# EAGLE schematic OSSI-1 Interface Board (EAGLE 6.5.0)

## Sheet 1 of 2
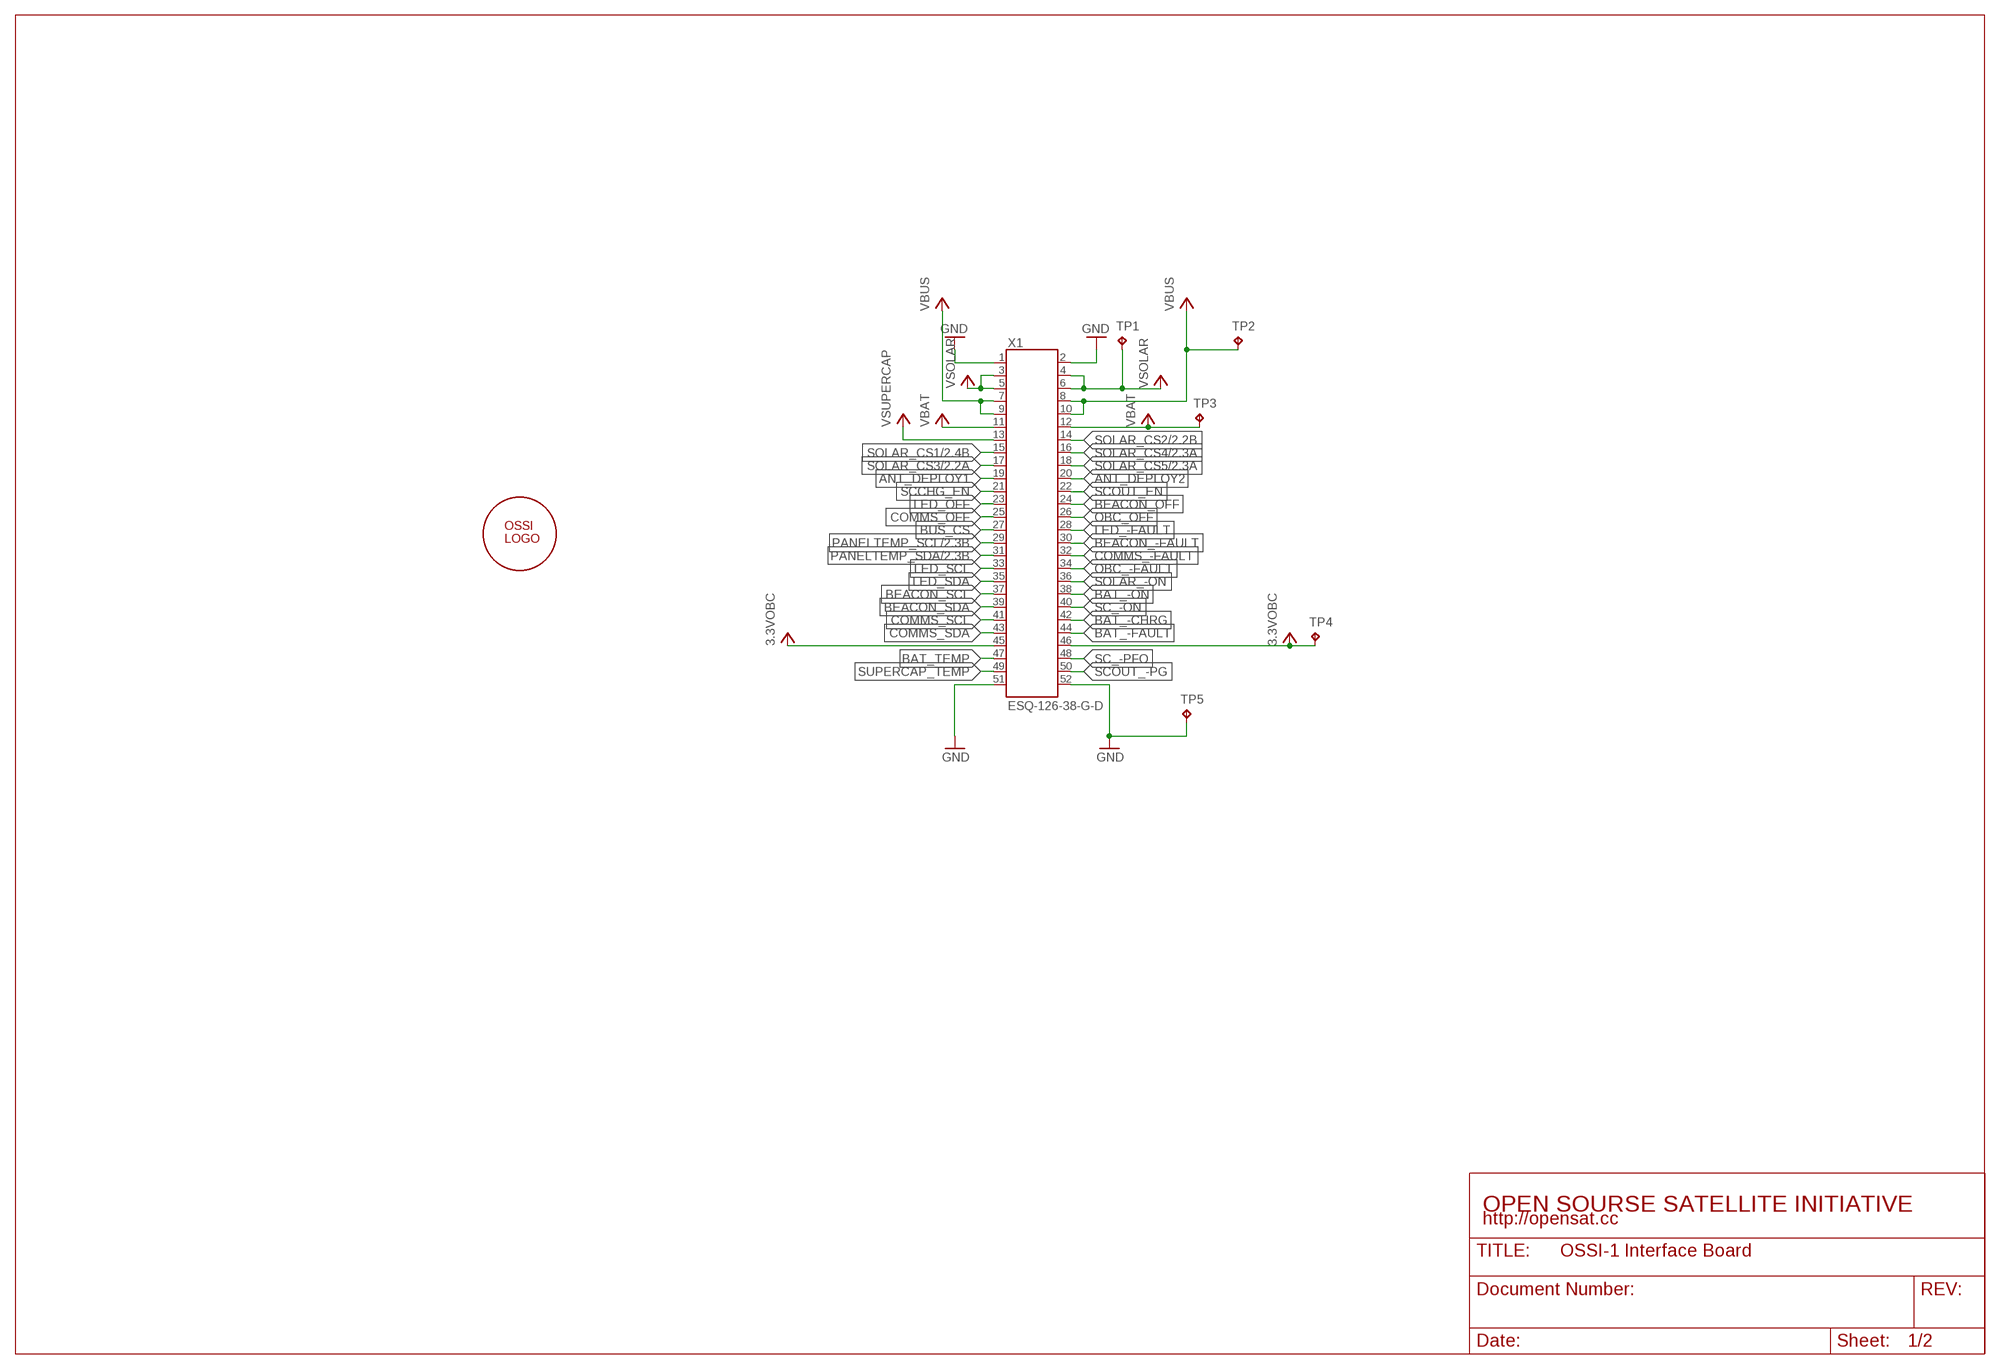
[diagram p0: schematic, sheet 1]

### Parts
TP1  TP  [TP-13]
TP2  TP  [TP-13]
TP3  TP  [TP-13]
TP4  TP  [TP-13]
TP5  TP  [TP-13]
U$1  OSSILOGO-10  [OSSILOGO1010]
X1  ESQ-126-38-G-D  [ESQ-126-XX-X-D]

### Nets
3.3VOBC: TP4.TP X1.45 X1.46 ; also sheet 2
ANT_DEPLOY1: X1.19
ANT_DEPLOY2: X1.20
BAT_-CHRG: X1.42
BAT_-FAULT: X1.44
BAT_-ON: X1.38
BAT_TEMP: X1.47
BEACON_-FAULT: X1.30
BEACON_OFF: X1.24
BEACON_SCL: X1.37
BEACON_SDA: X1.39
BUS_CS: X1.27
COMMS_-FAULT: X1.32
COMMS_OFF: X1.25
COMMS_SCL: X1.41
COMMS_SDA: X1.43
GND: TP5.TP X1.1 X1.2 X1.51 X1.52 ; also sheet 2
LED_-FAULT: X1.28
LED_OFF: X1.23
LED_SCL: X1.33
LED_SDA: X1.35
OBC_-FAULT: X1.34
OBC_OFF: X1.26
PANELTEMP_SCL: X1.29 ; also sheet 2
PANELTEMP_SDA: X1.31 ; also sheet 2
SC_-ON: X1.40
SC_-PFO: X1.48
SCCHG_EN: X1.21
SCOUT_-PG: X1.50
SCOUT_EN: X1.22
SOLAR_-ON: X1.36
SOLAR_CS1: X1.15 ; also sheet 2
SOLAR_CS2: X1.14 ; also sheet 2
SOLAR_CS3: X1.17 ; also sheet 2
SOLAR_CS4: X1.16 ; also sheet 2
SOLAR_CS5: X1.18 ; also sheet 2
SUPERCAP_TEMP: X1.49
VBAT: TP3.TP X1.11 X1.12
VBUS: TP2.TP X1.7 X1.8 X1.9 X1.10
VSOLAR: TP1.TP X1.3 X1.4 X1.5 X1.6 ; also sheet 2
VSUPERCAP: X1.13

### Notes on the sheet
- OPEN SOURSE SATELLITE INITIATIVE
- http://opensat.cc

## Sheet 2 of 2
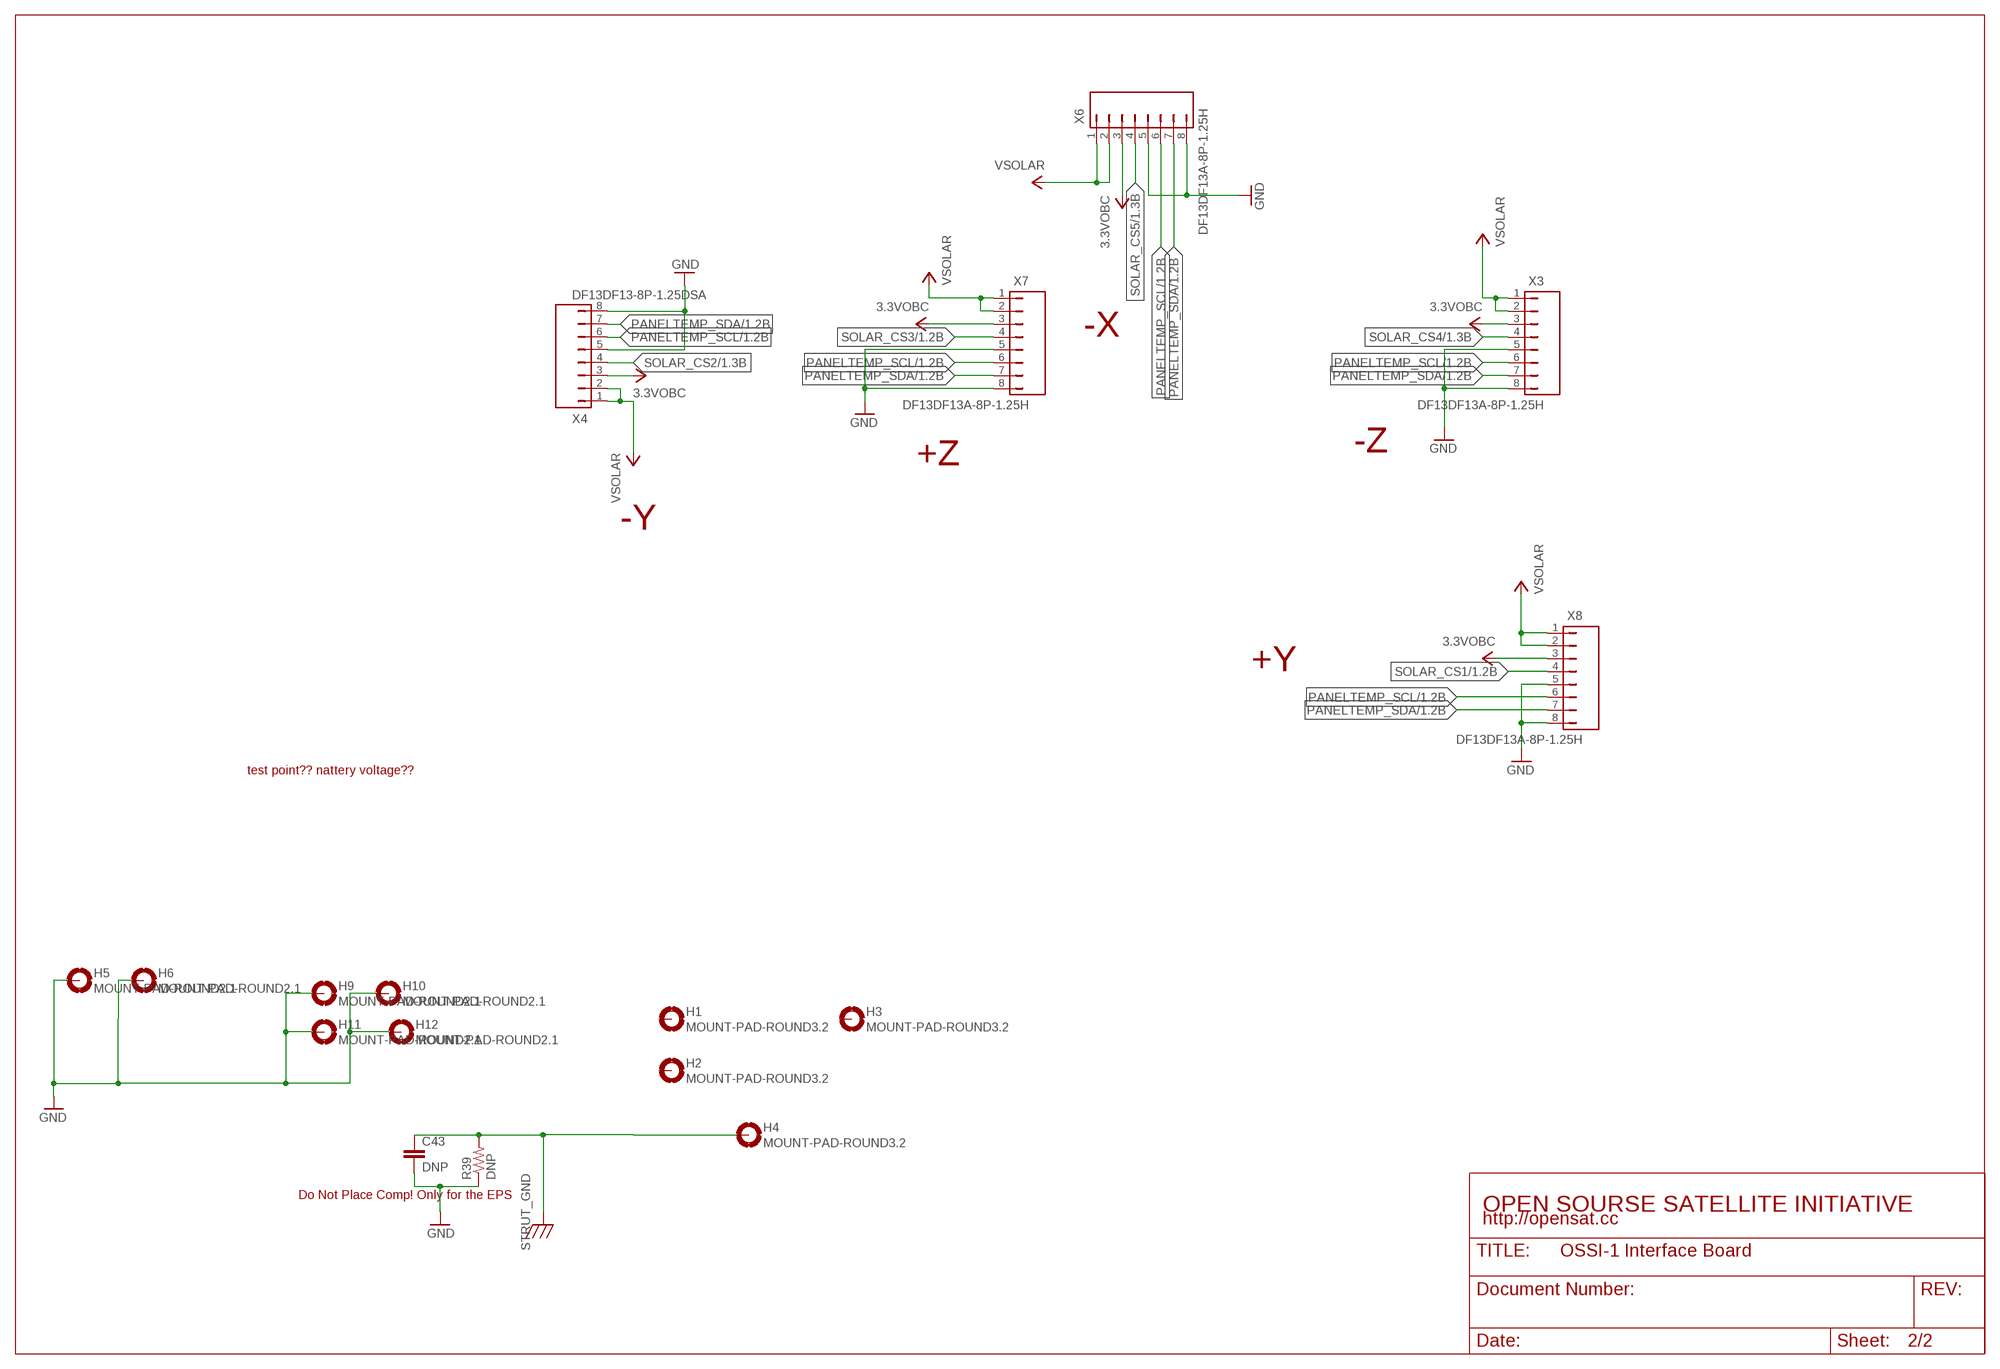
[diagram p1: schematic, sheet 2]

### Parts
C43  DNP  C0805(2012)  [C0805(2012)]
H1  MOUNT-PAD-ROUND3.2  [3.2-PAD-ROUND]
H2  MOUNT-PAD-ROUND3.2  [3.2-PAD-ROUND]
H3  MOUNT-PAD-ROUND3.2  [3.2-PAD-ROUND]
H4  MOUNT-PAD-ROUND3.2  [3.2-PAD-ROUND]
H5  MOUNT-PAD-ROUND2.1  [2.1-PAD-ROUND]
H6  MOUNT-PAD-ROUND2.1  [2.1-PAD-ROUND]
H9  MOUNT-PAD-ROUND2.1  [2.1-PAD-ROUND]
H10  MOUNT-PAD-ROUND2.1  [2.1-PAD-ROUND]
H11  MOUNT-PAD-ROUND2.1  [2.1-PAD-ROUND]
H12  MOUNT-PAD-ROUND2.1  [2.1-PAD-ROUND]
R39  DNP  RWSL1206  [WSL1206]
X3  DF13DF13A-8P-1.25H  [DF13A-8P]
X4  DF13DF13-8P-1.25DSA  [DF13-8P-1.25DSA]
X6  DF13DF13A-8P-1.25H  [DF13A-8P]
X7  DF13DF13A-8P-1.25H  [DF13A-8P]
X8  DF13DF13A-8P-1.25H  [DF13A-8P]

### Nets
3.3VOBC: X3.3 X4.3 X6.3 X7.3 X8.3 ; also sheet 1
GND: C43.2 H5.B3,2(MOUNT) H6.B3,2(MOUNT) H9.B3,2(MOUNT) H10.B3,2(MOUNT) H11.B3,2(MOUNT) H12.B3,2(MOUNT) R39.P$1 X3.5 X3.8 X4.5 X4.8 X6.5 X6.8 X7.5 X7.8 X8.5 X8.8 ; also sheet 1
PANELTEMP_SCL: X3.6 X4.6 X6.6 X7.6 X8.6 ; also sheet 1
PANELTEMP_SDA: X3.7 X4.7 X6.7 X7.7 X8.7 ; also sheet 1
SOLAR_CS1: X8.4 ; also sheet 1
SOLAR_CS2: X4.4 ; also sheet 1
SOLAR_CS3: X7.4 ; also sheet 1
SOLAR_CS4: X3.4 ; also sheet 1
SOLAR_CS5: X6.4 ; also sheet 1
STRUT_GND: C43.1 H4.B3,2(MOUNT) R39.P$2
VSOLAR: X3.1 X3.2 X4.1 X4.2 X6.1 X6.2 X7.1 X7.2 X8.1 X8.2 ; also sheet 1
Unconnected: H1.B3,2(MOUNT) H2.B3,2(MOUNT) H3.B3,2(MOUNT)

### Notes on the sheet
- -X
- -Z
- +Z
- -Y
- +Y
- test point?? nattery voltage??
- Do Not Place Comp! Only for the EPS
- OPEN SOURSE SATELLITE INITIATIVE
- http://opensat.cc

## Library data of the parts
C43 = OSSI:C
H1-H6 H9-H12 = OSSI:MOUNT-PAD-ROUND
R39 = OSSI:R
TP1-TP5 = OSSI:TP
U$1 = OSSI:OSSILOGO
X1 = OSSI:ESQ-126-: Samtec ESQ-126-XX-G-D Elevated Sockets Seires ESQ-126-37-G-D ESQ-126-38-G-D ESQ-126-39-G-D
X3 X4 X6-X8 = OSSI:DF13: Hirose DF13 series connector